# Altium schematic sheet WIFI.SchDoc (part 1 of 2)
size A; SheetNumber: 8; SheetTotal: 8
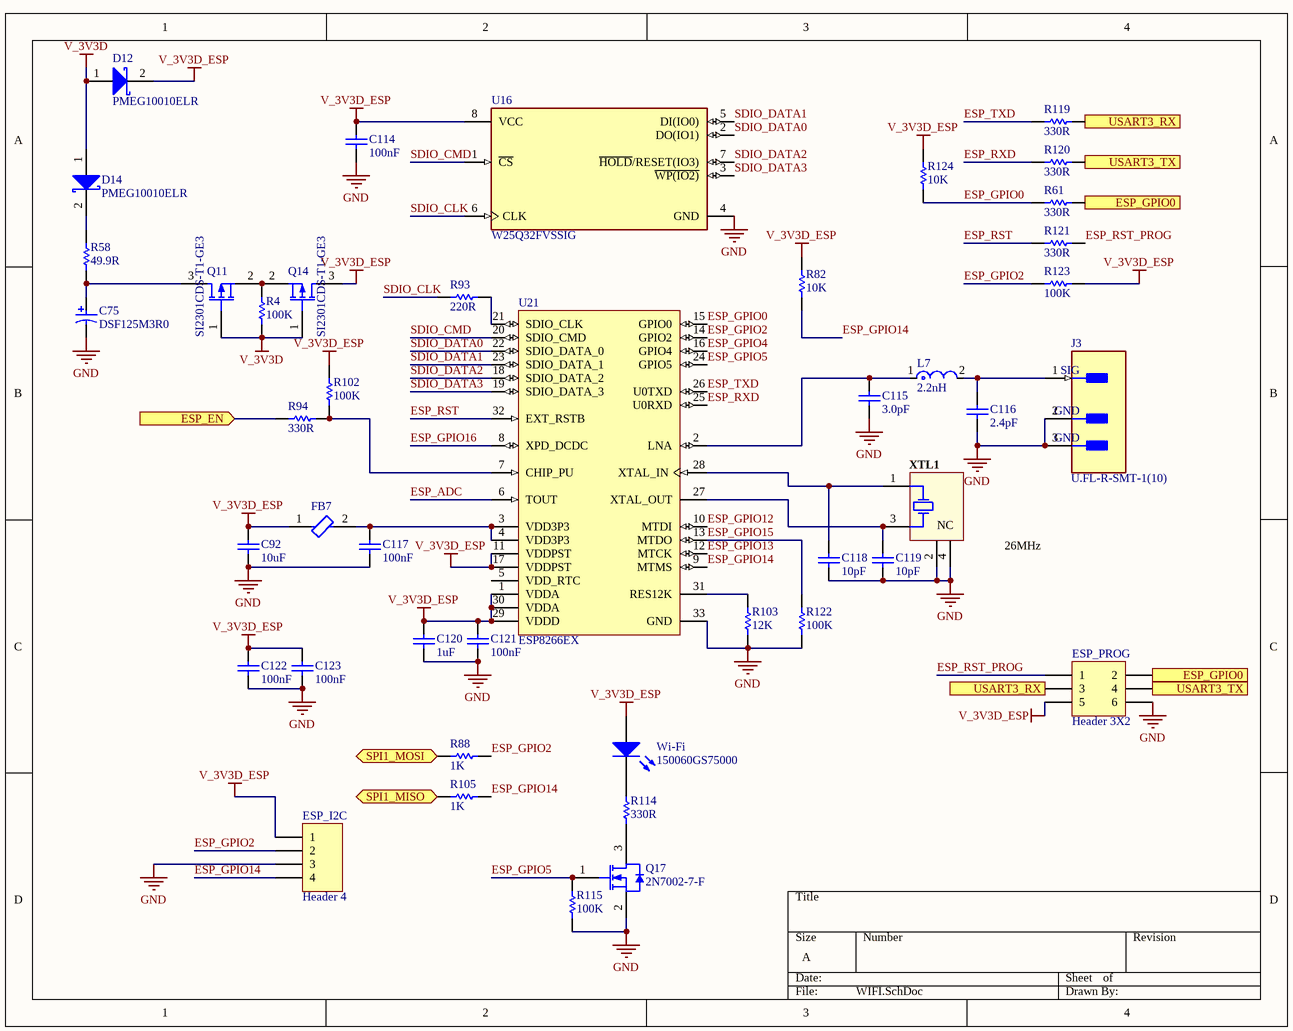
[diagram p0: WIFI.SchDoc]

## Parts
C75  DSF125M3R0  [CAPPR55-250-1120X630X1220]
C92  10uF  [CAPC2013X140X45NL15T25]
C114  100nF  [CAPC1608X90X35NL10T15]
C115  3.0pF  [CAPC1005X55X25NL05T10]
C116  2.4pF  [CAPC1005X55X25NL05T10]
C117  100nF  [CAPC1005X56X25NL10T15]
C118  10pF  [CAPC1005X55X25NL05T10]
C119  10pF  [CAPC1005X55X25NL05T10]
C120  1uF  [CAPC1608X86X35NL15T15]
C121  100nF  [CAPC1005X56X25NL10T15]
C122  100nF  [CAPC1005X56X25NL10T15]
C123  100nF  [CAPC1005X56X25NL10T15]
D12  PMEG10010ELR  [DIOD-SOD-123-2_V]
D14  PMEG10010ELR  [DIOD-SOD-123-2_V]
ESP_I2C  Header 4  [HDR1X4]
ESP_PROG  Header 3X2  [HDR2X3]
FB7  BLM15AG601SN1D  [FP-BLM15-0_05-IPC_B]  (value not drawn)
J3  U.FL-R-SMT-1(10)  [FP-U_FL-R-SMT-1_10-MFG]
L7  2.2nH  [FP-LQG15HH_02-MFG]
Q11  SI2301CDS-T1-GE3  [INF-PG-SOT23_N]
Q14  SI2301CDS-T1-GE3  [INF-PG-SOT23_N]
Q17  2N7002-7-F  [DIOD-SOT23-3_V]
R4  100K  [RESC1608X55X25NL10T15]
R58  49.9R  [RESC1608X55X30ML15T15]
R61  330R  [RESC1608X55X25NL10T15]
R82  10K  [RESC1005X40X25NL05T10]
R88  1K  [RESC1005X40X25NL05T10]
R93  220R  [RESC1005X40X25NL05T10]
R94  330R  [RESC1608X55X25NL10T15]
R102  100K  [RESC1608X55X25NL10T15]
R103  12K  [RESC1005X40X25ML05T05]
R105  1K  [RESC1005X40X25NL05T10]
R114  330R  [RESC1608X55X25NL10T15]
R115  100K  [RESC1608X55X25ML10T15]
R119  330R  [RESC1608X55X25NL10T15]
R120  330R  [RESC1608X55X25NL10T15]
R121  330R  [RESC1608X55X25NL10T15]
R122  100K  [RESC1608X55X25NL10T15]
R123  100K  [RESC1608X55X25NL10T15]
R124  10K  [RESC1608X55X25NL10T15]
U16  W25Q32FVSSIG  [FP-SS-MFG]
U21  ESP8266EX  [ESFS-QFN-32_L]
Wi-Fi  150060GS75000  [0603_A]
XTL1  26MHz  [AVX-CX3225GB-4_V]

## Ports
ESP_EN (in), ESP_GPIO0 (out), SPI1_MISO (bidir), SPI1_MOSI (bidir), USART3_RX (out), USART3_TX (in)

## Nets
GND: C75.2 C92.1 C114.1 C115.1 C116.1 C117.1 C118.2 C119.2 C120.1 C121.1 C122.1 C123.1 ESP_I2C.3 ESP_PROG.6 J3.2(GND) J3.3(GND) Q17.2(S) R103.1 R115.1 R122.1 U16.4(GND) U21.33(GND) XTL1.2(NC) XTL1.4(NC)
V_3V3D: D12.1(A) D14.1(A) Q11.1(G) Q14.1(G) R4.1
V_3V3D_ESP: C92.2 C114.2 C120.2 C121.2 C122.2 C123.2 D12.2(K) ESP_I2C.1 ESP_PROG.5 FB7.1 Q14.3(D) R82.2 R102.1 R123.2 R124.2 U16.8(VCC) U21.1(VDDA) U21.11(VDDPST) U21.17(VDDPST) U21.29(VDDD) U21.30(VDDA) Wi-Fi.2(A)
ESP_ADC: U21.6(TOUT)
ESP_EN: R94.2 ; port ESP_EN
ESP_GPIO0: R61.1 R124.1 U21.15(GPIO0)
ESP_GPIO0: ESP_PROG.2 R61.2 ; port ESP_GPIO0  [a separate net that carries the same name]
ESP_GPIO2: ESP_I2C.2 R88.2 R123.1 U21.14(GPIO2)
ESP_GPIO4: U21.16(GPIO4)
ESP_GPIO5: Q17.1(G) R115.2 U21.24(GPIO5)
ESP_GPIO12: U21.10(MTDI)
ESP_GPIO13: U21.12(MTCK)
ESP_GPIO14: ESP_I2C.4 R82.1 R105.2 U21.9(MTMS)
ESP_GPIO15: R122.2 U21.13(MTDO)
ESP_GPIO16: U21.8(XPD_DCDC)
ESP_RST: R121.1 U21.32(EXT_RSTB)
ESP_RST_PROG: ESP_PROG.1 R121.2
ESP_RXD: R120.1 U21.25(U0RXD)
ESP_TXD: R119.1 U21.26(U0TXD)
SDIO_CLK: R93.1 U16.6(CLK)
SDIO_CMD: U16.1(~{CS}) U21.20(SDIO_CMD)
SDIO_DATA0: U16.2(DO(IO1)) U21.22(SDIO_DATA_0)
SDIO_DATA1: U16.5(DI(IO0)) U21.23(SDIO_DATA_1)
SDIO_DATA2: U16.7(~{HOLD}/RESET(IO3)) U21.18(SDIO_DATA_2)
SDIO_DATA3: U16.3(~{WP(IO2)}) U21.19(SDIO_DATA_3)
SPI1_MISO: R105.1 ; port SPI1_MISO
SPI1_MOSI: R88.1 ; port SPI1_MOSI
USART3_RX: ESP_PROG.3 R119.2 ; port USART3_RX
USART3_TX: ESP_PROG.4 R120.2 ; port USART3_TX
NetC75_1: C75.1 Q11.3(D) R58.1
NetC115_2: C115.2 L7.1 U21.2(LNA)
NetC116_2: C116.2 J3.1(SIG) L7.2
NetC117_2: C117.2 FB7.2 U21.3(VDD3P3) U21.4(VDD3P3)
NetC118_1: C118.1 U21.28(XTAL_IN) XTL1.1(HOT)
NetC119_1: C119.1 U21.27(XTAL_OUT) XTL1.3(HOT)
NetD14_2: D14.2(K) R58.2
NetQ11_2: Q11.2(S) Q14.2(S) R4.2
NetQ17_3: Q17.3(D) R114.2
NetR93_2: R93.2 U21.21(SDIO_CLK)
NetR94_1: R94.1 R102.2 U21.7(CHIP_PU)
NetR103_2: R103.2 U21.31(RES12K)
NetR114_1: R114.1 Wi-Fi.1(K)

Not connected (* = marked no-connect by the designer): U21 5(VDD_RTC)